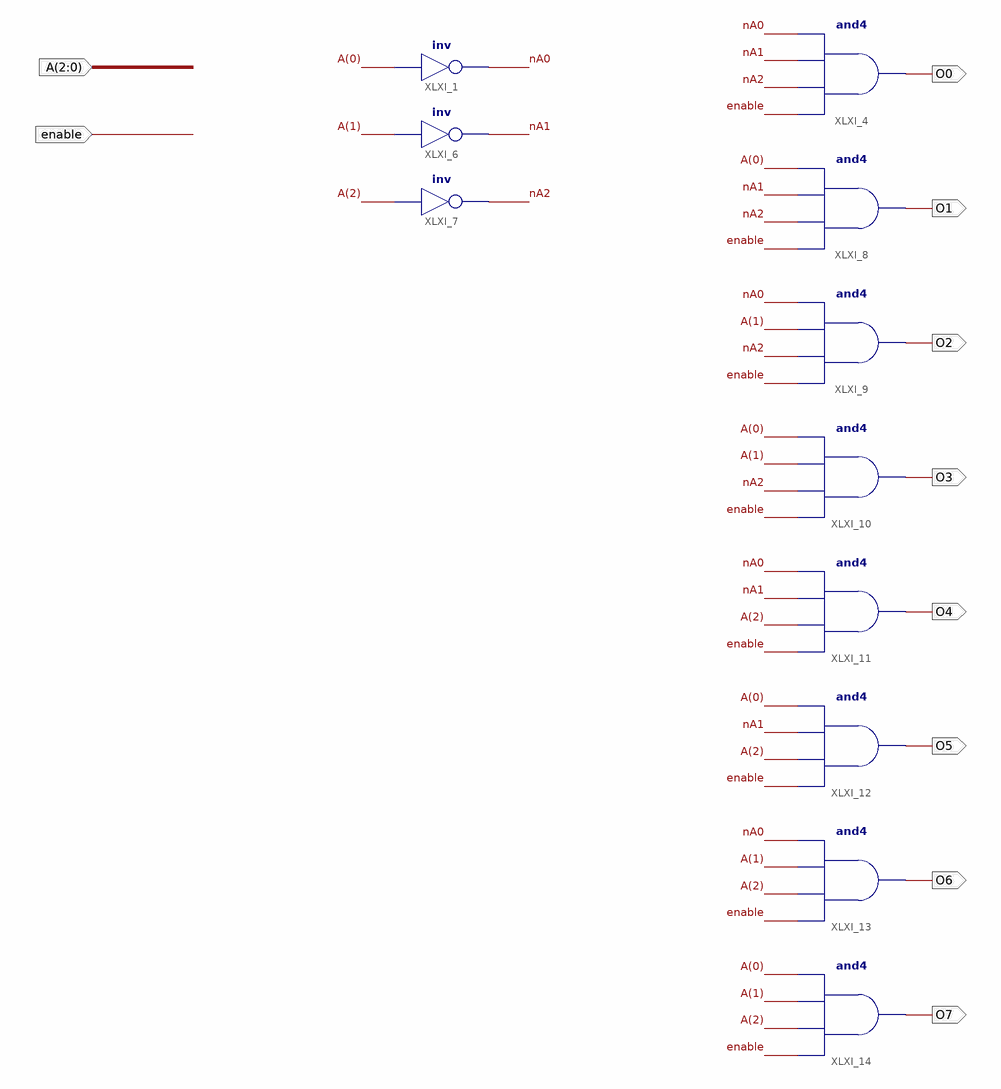
[diagram p0: schematic sheet 1]
// Xilinx ISE schematic decode3b8.sch (spartan3e) as structural Verilog: 11 symbols, 10 ports
module decode3b8 (
  input  [2:0] A,
  input  enable,
  output O0,
  output O1,
  output O2,
  output O3,
  output O5,
  output O6,
  output O7,
  output O4
);

  wire nA0, nA1, nA2;

  not XLXI_1 (nA0, A[0]);
  not XLXI_6 (nA1, A[1]);
  not XLXI_7 (nA2, A[2]);
  and XLXI_4 (O0, enable, nA2, nA1, nA0);
  and XLXI_8 (O1, enable, nA2, nA1, A[0]);
  and XLXI_9 (O2, enable, nA2, A[1], nA0);
  and XLXI_10 (O3, enable, nA2, A[1], A[0]);
  and XLXI_12 (O5, enable, A[2], nA1, A[0]);
  and XLXI_13 (O6, enable, A[2], A[1], nA0);
  and XLXI_14 (O7, enable, A[2], A[1], A[0]);
  and XLXI_11 (O4, enable, A[2], nA1, nA0);
endmodule
